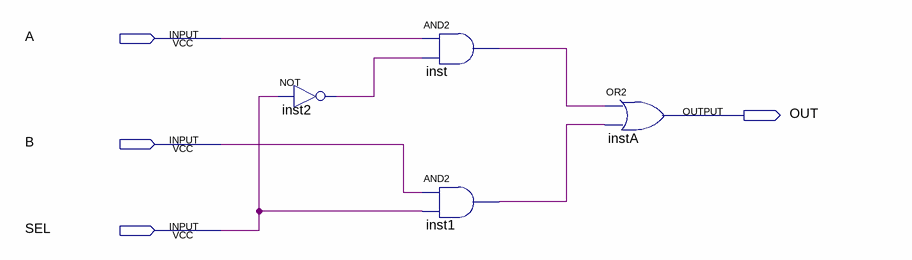
[diagram p0: schematic sheet]
// Quartus schematic MUX21.bdf as structural Verilog: 4 symbols, 4 pins
module MUX21 (
  input  A,
  input  B,
  input  SEL,
  output OUT
);

  wire inst1_out, inst2_out, inst_out;

  not inst2 (inst2_out, SEL);
  and inst (inst_out, A, inst2_out);
  and inst1 (inst1_out, B, SEL);
  or instA (OUT, inst_out, inst1_out);
endmodule
